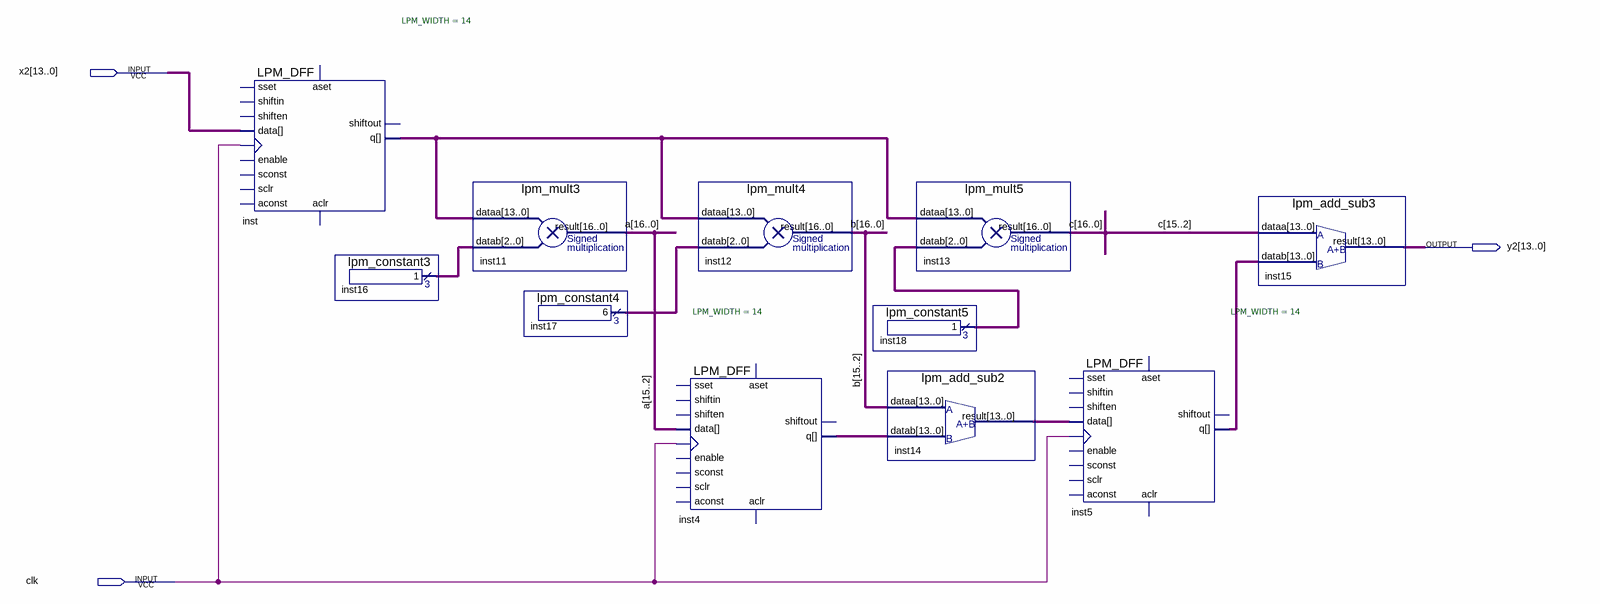
[diagram p0: schematic sheet]
// Quartus schematic Hochpass.bdf as structural Verilog: 11 symbols, 3 pins
module Hochpass (
  input  [13:0] x2,
  input  clk,
  output [13:0] y2
);

  wire [2:0] inst16_result, inst17_result, inst18_result;
  wire [13:0] inst4_q, inst5_q, inst14_result, inst_q;
  wire [16:0] a, b, c;

  LPM_DFF #(.LPM_WIDTH(14)) inst (
    .clock(clk), .data(x2), .q(inst_q));  // open: shiftin, shiften, enable, aconst, sclr, sconst, sset, aset, aclr, shiftout
  lpm_constant3 inst16 (.result(inst16_result));
  lpm_mult3 inst11 (.dataa(inst_q), .datab(inst16_result), .result(a));
  lpm_constant4 inst17 (.result(inst17_result));
  LPM_DFF #(.LPM_WIDTH(14)) inst4 (
    .clock(clk), .data(a[15:2]), .q(inst4_q));  // open: shiftin, shiften, enable, aconst, sclr, sconst, sset, aset, aclr, shiftout
  lpm_mult4 inst12 (.dataa(inst_q), .datab(inst17_result), .result(b));
  lpm_mult5 inst13 (.dataa(inst_q), .datab(inst18_result), .result(c));
  lpm_constant5 inst18 (.result(inst18_result));
  lpm_add_sub2 inst14 (.dataa(b[15:2]), .datab(inst4_q), .result(inst14_result));
  LPM_DFF #(.LPM_WIDTH(14)) inst5 (
    .clock(clk), .data(inst14_result), .q(inst5_q));  // open: shiftin, shiften, enable, aconst, sclr, sconst, sset, aset, aclr, shiftout
  lpm_add_sub3 inst15 (.dataa(c[15:2]), .datab(inst5_q), .result(y2));
endmodule
